# Altium schematic sheet Connectors.SchDoc
size A; SheetNumber: 2; SheetTotal: 4
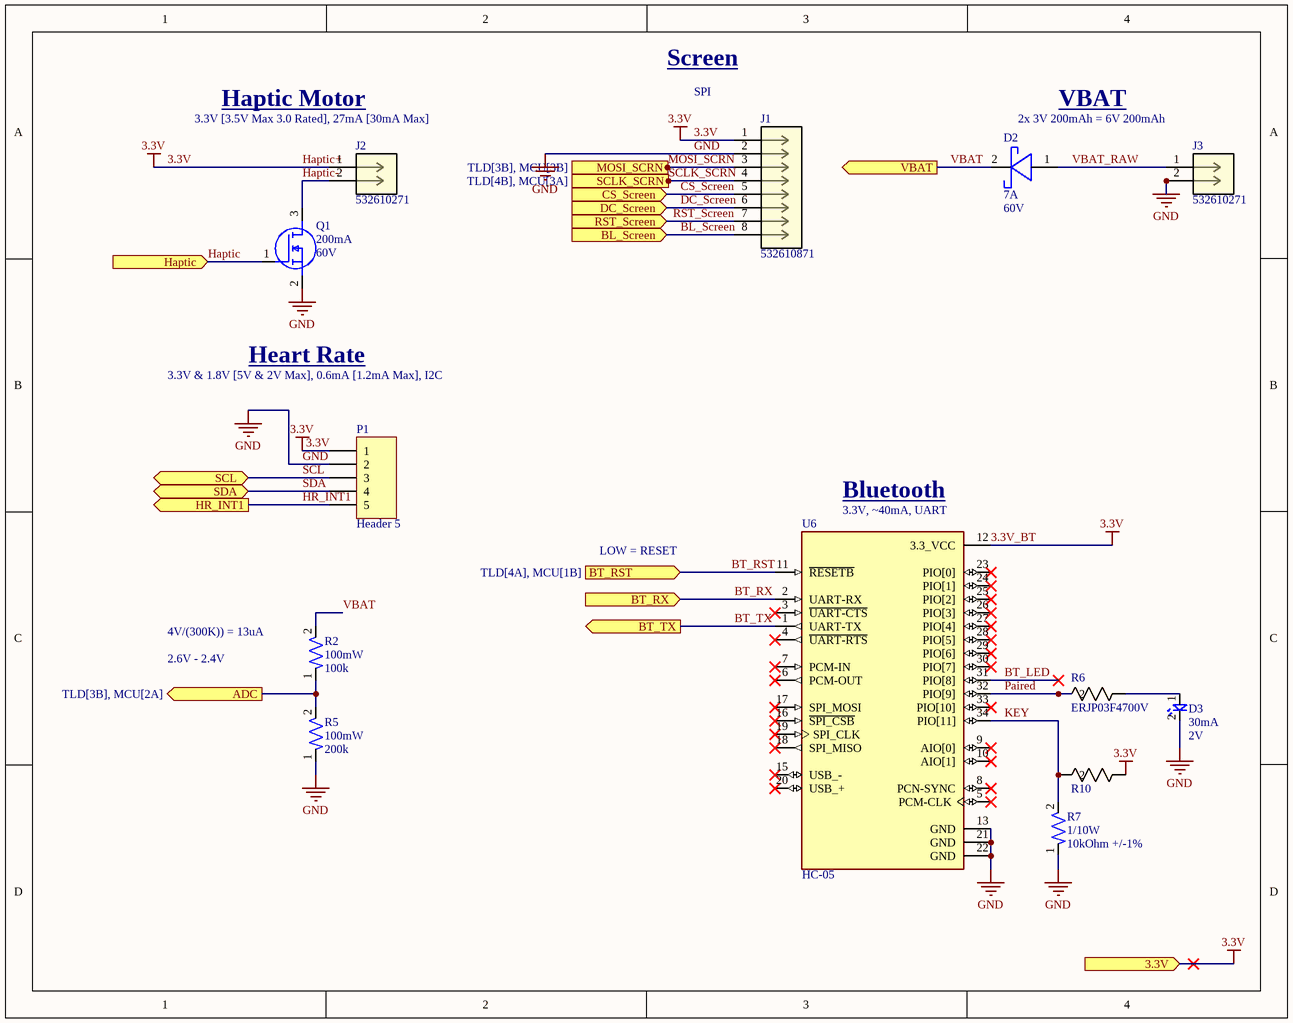
[diagram p0: Connectors.SchDoc]

## Parts
D2  Forward Current: 7A  Reverse Voltage (DC): 60V  [DO-POWERDI5]  (hidden comment: PDS760-13)
D3  Forward Current: 30mA  Forward Voltage: 2V  [LED-0603]  (hidden comment: BL-HKC36G-AV-TRB)
J1  532610871  [CONN_532610001-SD_08_MOL]
J2  532610271  [CONN_532610001-SD_02_MOL]
J3  532610271  [CONN_532610001-SD_02_MOL]
P1  Header 5  [HDR1X5]
Q1  Continuous Current: 200mA  Voltage: 60V  [IC-SOT23-3]  (hidden comment: T2N7002AK,LM)
R2  Power: 100mW  Resistance: 100k  [RES-0603]  (hidden comment: RC0603FR-07100KL)
R5  Power: 100mW  Resistance: 200k  [RES-0603]  (hidden comment: RC0603FR-07200KL)
R6  ERJP03F4700V  [RES_ERJP03_PAN]
R7  Power Rating: 1/10W  Resistance: 10kOhm +/-1%  [RES-0603]  (hidden comment: RC0603FR-0710KP)
R10  CRCW12100000Z0EA  [RES_CRCW_1210_VIS]  (value not drawn)
U6  HC-05  [XCVR_HC-05]

## Ports
3.3V (in, see TLD[3A], LDOs[1A], MCU[4D]), ADC (out, see TLD[3B], MCU[2A]), BL_Screen (in, see TLD[3B]), BT_RST (in, see TLD[4A], MCU[1B]), BT_RX (in, see TLD[4B]), BT_TX (out, see TLD[4B]), CS_Screen (in, see TLD[3B], MCU[1A]), DC_Screen (in, see TLD[3B], MCU[1A]), Haptic (in, see TLD[3B], MCU[1A]), HR_INT1 (out, see TLD[4B], MCU[1B]), MOSI_SCRN (in, see TLD[3B], MCU[3B]), RST_Screen (in, see TLD[3B], MCU[1A]), SCL (bidir, see TLD[4B], MCU[3D]), SCLK_SCRN (in, see TLD[4B], MCU[3A]), SDA (bidir, see TLD[4B], MCU[3D]), VBAT (out, see TLD[4B], LDOs[1A])

## Nets
3.3V: J1.1 J2.1 P1.1 R10.1 U6.12(3.3_VCC) ; port 3.3V  [also labelled 3.3V_BT, Haptic+]
GND: D3.2 J1.2 J3.2 P1.2 Q1.2(S) R5.1 R7.1 U6.13(GND) U6.21(GND) U6.22(GND)
ADC: R2.1 R5.2 ; port ADC
BL_Screen: J1.8 ; port BL_Screen
BT_LED: U6.31(PIO[8])
BT_RST: U6.11(~{RESETB}) ; port BT_RST
BT_RX: U6.2(UART-RX) ; port BT_RX
BT_TX: U6.1(UART-TX) ; port BT_TX
CS_Screen: J1.5 ; port CS_Screen
DC_Screen: J1.6 ; port DC_Screen
Haptic: Q1.1(G) ; port Haptic
Haptic-: J2.2 Q1.3(D)
HR_INT1: P1.5 ; port HR_INT1
KEY: R7.2 R10.2 U6.34(PIO[11])
MOSI_SCRN: J1.3 ; port MOSI_SCRN
Paired: R6.2 U6.32(PIO[9])
RST_Screen: J1.7 ; port RST_Screen
SCL: P1.3 ; port SCL
SCLK_SCRN: J1.4 ; port SCLK_SCRN
SDA: P1.4 ; port SDA
VBAT: D2.2(ANODE) R2.2 ; port VBAT
VBAT_RAW: D2.1(CATHODE) J3.1
NetD3_1: D3.1 R6.1

Not connected (* = marked no-connect by the designer): U6 3(~{UART-CTS})* 4(~{UART-RTS})* 5(PCM-CLK)* 6(PCM-OUT)* 7(PCM-IN)* 8(PCN-SYNC)* 9(AIO[0])* 10(AIO[1])* 15(USB_-)* 16(~{SPI_CSB})* 17(SPI_MOSI)* 18(SPI_MISO)* 19(SPI_CLK)* 20(USB_+)* 23(PIO[0])* 24(PIO[1])* 25(PIO[2])* 26(PIO[3])* 27(PIO[4])* 28(PIO[5])* 29(PIO[6])* 30(PIO[7])* 33(PIO[10])*

## Notes on the sheet
- Screen
- SPI
- (near J2) 3.3V [3.5V Max 3.0 Rated], 27mA [30mA Max]
- Haptic Motor
- 2x 3V 200mAh = 6V 200mAh
- VBAT
- Heart Rate
- 3.3V & 1.8V [5V & 2V Max], 0.6mA [1.2mA Max], I2C
- (near U6) Bluetooth
- LOW = RESET
- (near U6) 3.3V, ~40mA, UART
- (near R2) 4V/(300K)) = 13uA
- 2.6V - 2.4V

## Library data of the parts
D2 = DIO-SCHOTTKY-0001: DIODE SCHOTTKY 60V 7A POWERDI5; ComponentLink1Description: Datasheet; ComponentLink1URL: https://www.diodes.com/assets/Datasheets/PDS760.pdf
D3 = LED-0001: LED YELLOW CLEAR 0603 SMD; ComponentLink1Description: Datasheet; ComponentLink1URL: https://www.americanbrightled.com/pdffiles/led-components/smt/BL-HKC36G-AV-TRB.pdf
J1 = Header-PICO-8: No Description Available; Mfr_Name: Molex Connector Corporation; RefDes: RefDes; Type: Type; ComponentLink1Description: Datasheet; ComponentLink1URL: https://www.molex.com/content/dam/molex/molex-dot-com/products/automated/en-us/salesdrawingpdf/532/53261/532610871_sd.pdf?inline
J2 J3 = Header-PICO-2: No Description Available; Mfr_Name: Molex Connector Corporation; RefDes: RefDes; Type: Type; ComponentLink1Description: Datasheet; ComponentLink1URL: https://www.molex.com/content/dam/molex/molex-dot-com/products/automated/en-us/salesdrawingpdf/532/53261/532610271_sd.pdf?inline
P1 = Header 5: Header, 5-Pin; LatestRevisionDate: 17-Jul-2002; LatestRevisionNote: Re-released for DXP Platform.; Publisher: Altium Limited
Q1 = NMOS-200MA-0001: MOSFET N-CH 60V 200MA SOT23; ComponentLink1Description: Datasheet; ComponentLink1URL: https://toshiba.semicon-storage.com/info/T2N7002AK_datasheet_en_20150401.pdf?did=29712&prodName=T2N7002AK
R2 = RES-100k-0001: RES SMD 100K OHM 1% 1/10W 0603; Tolerance: 1%; Size: 0603; ComponentLink1Description: Datasheet; ComponentLink1URL: https://www.yageo.com/upload/media/product/products/datasheet/rchip/PYu-RC_Group_51_RoHS_L_12.pdf
R5 = RES-200k-0001: RES SMD 200K OHM 1% 1/10W 0603; Tolerance: 1%; Size: 0603; ComponentLink1Description: Datasheet; ComponentLink1URL: https://www.yageo.com/upload/media/product/products/datasheet/rchip/PYu-RC_Group_51_RoHS_L_12.pdf
R6 = RES-470-0603: 470 Ohms ±1% 0.2W, 1/5W Chip Resistor 0603 (1608 Metric) Automotive AEC-Q200, Pulse Withstanding Thick Film; Mfr_Name: Panasonic; ComponentLink1Description: Datasheet; ComponentLink1URL: https://industrial.panasonic.com/cdbs/www-data/pdf/RDO0000/AOA0000C331.pdf
R7 = RES-10K-0002: RES SMD 10K OHM 1% 1/10W 0603; Manufacturer: YAGEO; Assembled?: no; Manufacturer Part Number: RC0603FR-0710KP; Package Size: 0603
R10 = RES-0-1: No Description Available; Mfr_Name: Vishay; ComponentLink1Description: Datasheet; ComponentLink1URL: https://www.vishay.com/docs/20035/dcrcwe3.pdf
U6 = HC-05: Bluetooth to Serial Port Module; MF: ITead Studio; SnapEDA_Link: https://www.snapeda.com/parts/HC-05/ITEAD/view-part/?ref=snap; Package: Module ITead Studio; Value: *; MP: HC-05; Check_prices: https://www.snapeda.com/parts/HC-05/ITEAD/view-part/?ref=eda; ComponentLink1Description: Datasheet; ComponentLink1URL: https://components101.com/sites/default/files/component_datasheet/HC06%20Bluetooth%20Module%20Datasheet.pdf; ComponentLink2Description: Datasheet2; ComponentLink2URL: https://dcc-ex.com/reference/hardware/bluetooth/hc-05-06.html#gsc.tab=0